# EAGLE design schematic (EAGLE 9.3.1)
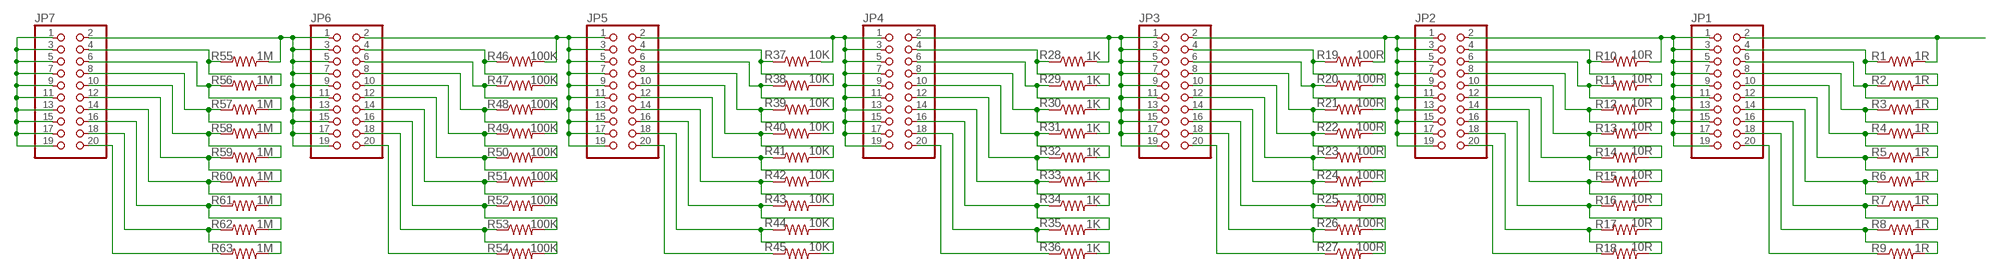
[diagram p0: schematic, sheet 1]

## Parts
JP1  PINHD-2X10_2.54-SMD  [2X10SMD]
JP2  PINHD-2X10_2.54-SMD  [2X10SMD]
JP3  PINHD-2X10_2.54-SMD  [2X10SMD]
JP4  PINHD-2X10_2.54-SMD  [2X10SMD]
JP5  PINHD-2X10_2.54-SMD  [2X10SMD]
JP6  PINHD-2X10_2.54-SMD  [2X10SMD]
JP7  PINHD-2X10_2.54-SMD  [2X10SMD]
R1  1R  RESISTOR1206  [1206]
R2  1R  RESISTOR1206  [1206]
R3  1R  RESISTOR1206  [1206]
R4  1R  RESISTOR1206  [1206]
R5  1R  RESISTOR1206  [1206]
R6  1R  RESISTOR1206  [1206]
R7  1R  RESISTOR1206  [1206]
R8  1R  RESISTOR1206  [1206]
R9  1R  RESISTOR1206  [1206]
R10  10R  RESISTOR2512  [R2512]
R11  10R  RESISTOR2512  [R2512]
R12  10R  RESISTOR2512  [R2512]
R13  10R  RESISTOR2512  [R2512]
R14  10R  RESISTOR2512  [R2512]
R15  10R  RESISTOR2512  [R2512]
R16  10R  RESISTOR2512  [R2512]
R17  10R  RESISTOR2512  [R2512]
R18  10R  RESISTOR2512  [R2512]
R19  100R  RESISTOR2512  [R2512]
R20  100R  RESISTOR2512  [R2512]
R21  100R  RESISTOR2512  [R2512]
R22  100R  RESISTOR2512  [R2512]
R23  100R  RESISTOR2512  [R2512]
R24  100R  RESISTOR2512  [R2512]
R25  100R  RESISTOR2512  [R2512]
R26  100R  RESISTOR2512  [R2512]
R27  100R  RESISTOR2512  [R2512]
R28  1K  RESISTOR2512  [R2512]
R29  1K  RESISTOR2512  [R2512]
R30  1K  RESISTOR2512  [R2512]
R31  1K  RESISTOR2512  [R2512]
R32  1K  RESISTOR2512  [R2512]
R33  1K  RESISTOR2512  [R2512]
R34  1K  RESISTOR2512  [R2512]
R35  1K  RESISTOR2512  [R2512]
R36  1K  RESISTOR2512  [R2512]
R37  10K  RESISTOR2512  [R2512]
R38  10K  RESISTOR2512  [R2512]
R39  10K  RESISTOR2512  [R2512]
R40  10K  RESISTOR2512  [R2512]
R41  10K  RESISTOR2512  [R2512]
R42  10K  RESISTOR2512  [R2512]
R43  10K  RESISTOR2512  [R2512]
R44  10K  RESISTOR2512  [R2512]
R45  10K  RESISTOR2512  [R2512]
R46  100K  RESISTOR2512  [R2512]
R47  100K  RESISTOR2512  [R2512]
R48  100K  RESISTOR2512  [R2512]
R49  100K  RESISTOR2512  [R2512]
R50  100K  RESISTOR2512  [R2512]
R51  100K  RESISTOR2512  [R2512]
R52  100K  RESISTOR2512  [R2512]
R53  100K  RESISTOR2512  [R2512]
R54  100K  RESISTOR2512  [R2512]
R55  1M  RESISTOR2512  [R2512]
R56  1M  RESISTOR2512  [R2512]
R57  1M  RESISTOR2512  [R2512]
R58  1M  RESISTOR2512  [R2512]
R59  1M  RESISTOR2512  [R2512]
R60  1M  RESISTOR2512  [R2512]
R61  1M  RESISTOR2512  [R2512]
R62  1M  RESISTOR2512  [R2512]
R63  1M  RESISTOR2512  [R2512]

## Nets
N$1: JP1.1 JP1.3 JP1.5 JP1.7 JP1.9 JP1.11 JP1.13 JP1.15 JP1.17 JP1.19 JP2.2 R10.2
N$2: JP1.2 R1.2
N$3: JP1.6 R2.1 R3.2
N$4: JP1.4 R1.1 R2.2
N$5: JP1.8 R3.1 R4.2
N$6: JP1.10 R4.1 R5.2
N$7: JP1.12 R5.1 R6.2
N$8: JP1.14 R6.1 R7.2
N$9: JP1.16 R7.1 R8.2
N$10: JP1.18 R8.1 R9.2
N$11: JP1.20 R9.1
N$12: JP2.1 JP2.3 JP2.5 JP2.7 JP2.9 JP2.11 JP2.13 JP2.15 JP2.17 JP2.19 JP3.2 R19.2
N$13: JP4.1 JP4.3 JP4.5 JP4.7 JP4.9 JP4.11 JP4.13 JP4.15 JP4.17 JP4.19 JP5.2 R37.2
N$14: JP2.4 R10.1 R11.2
N$15: JP2.6 R11.1 R12.2
N$16: JP2.8 R12.1 R13.2
N$17: JP2.10 R13.1 R14.2
N$18: JP2.12 R14.1 R15.2
N$19: JP2.14 R15.1 R16.2
N$20: JP2.16 R16.1 R17.2
N$21: JP2.18 R17.1 R18.2
N$22: JP2.20 R18.1
N$23: JP3.1 JP3.3 JP3.5 JP3.7 JP3.9 JP3.11 JP3.13 JP3.15 JP3.17 JP3.19 JP4.2 R28.2
N$24: JP6.1 JP6.3 JP6.5 JP6.7 JP6.9 JP6.11 JP6.13 JP6.15 JP6.17 JP6.19 JP7.2 R55.2
N$25: JP3.4 R19.1 R20.2
N$26: JP3.6 R20.1 R21.2
N$27: JP3.8 R21.1 R22.2
N$28: JP3.10 R22.1 R23.2
N$29: JP3.12 R23.1 R24.2
N$30: JP3.14 R24.1 R25.2
N$31: JP3.16 R25.1 R26.2
N$32: JP3.18 R26.1 R27.2
N$33: JP3.20 R27.1
N$36: JP4.4 R28.1 R29.2
N$37: JP4.6 R29.1 R30.2
N$38: JP4.8 R30.1 R31.2
N$39: JP4.10 R31.1 R32.2
N$40: JP4.12 R32.1 R33.2
N$41: JP4.14 R33.1 R34.2
N$42: JP4.16 R34.1 R35.2
N$43: JP4.18 R35.1 R36.2
N$44: JP4.20 R36.1
N$45: JP5.1 JP5.3 JP5.5 JP5.7 JP5.9 JP5.11 JP5.13 JP5.15 JP5.17 JP5.19 JP6.2 R46.2
N$47: JP5.4 R37.1 R38.2
N$48: JP5.6 R38.1 R39.2
N$49: JP5.8 R39.1 R40.2
N$50: JP5.10 R40.1 R41.2
N$51: JP5.12 R41.1 R42.2
N$52: JP5.14 R42.1 R43.2
N$53: JP5.16 R43.1 R44.2
N$54: JP5.18 R44.1 R45.2
N$55: JP5.20 R45.1
N$57: JP7.1 JP7.3 JP7.5 JP7.7 JP7.9 JP7.11 JP7.13 JP7.15 JP7.17 JP7.19
N$58: JP6.4 R46.1 R47.2
N$59: JP6.6 R47.1 R48.2
N$60: JP6.8 R48.1 R49.2
N$61: JP6.10 R49.1 R50.2
N$62: JP6.12 R50.1 R51.2
N$63: JP6.14 R51.1 R52.2
N$64: JP6.16 R52.1 R53.2
N$65: JP6.18 R53.1 R54.2
N$66: JP6.20 R54.1
N$69: JP7.4 R55.1 R56.2
N$70: JP7.6 R56.1 R57.2
N$71: JP7.8 R57.1 R58.2
N$72: JP7.10 R58.1 R59.2
N$73: JP7.12 R59.1 R60.2
N$74: JP7.14 R60.1 R61.2
N$75: JP7.16 R61.1 R62.2
N$76: JP7.18 R62.1 R63.2
N$77: JP7.20 R63.1

## Library data of the parts
JP1-JP7 = pinhead-2:PINHD-2X10: PIN HEADER
R1-R63 = SparkFun-Passives:RESISTOR: Resistor Basic schematic elements and footprints for 0603, 1206, and PTH resistors.

## Board
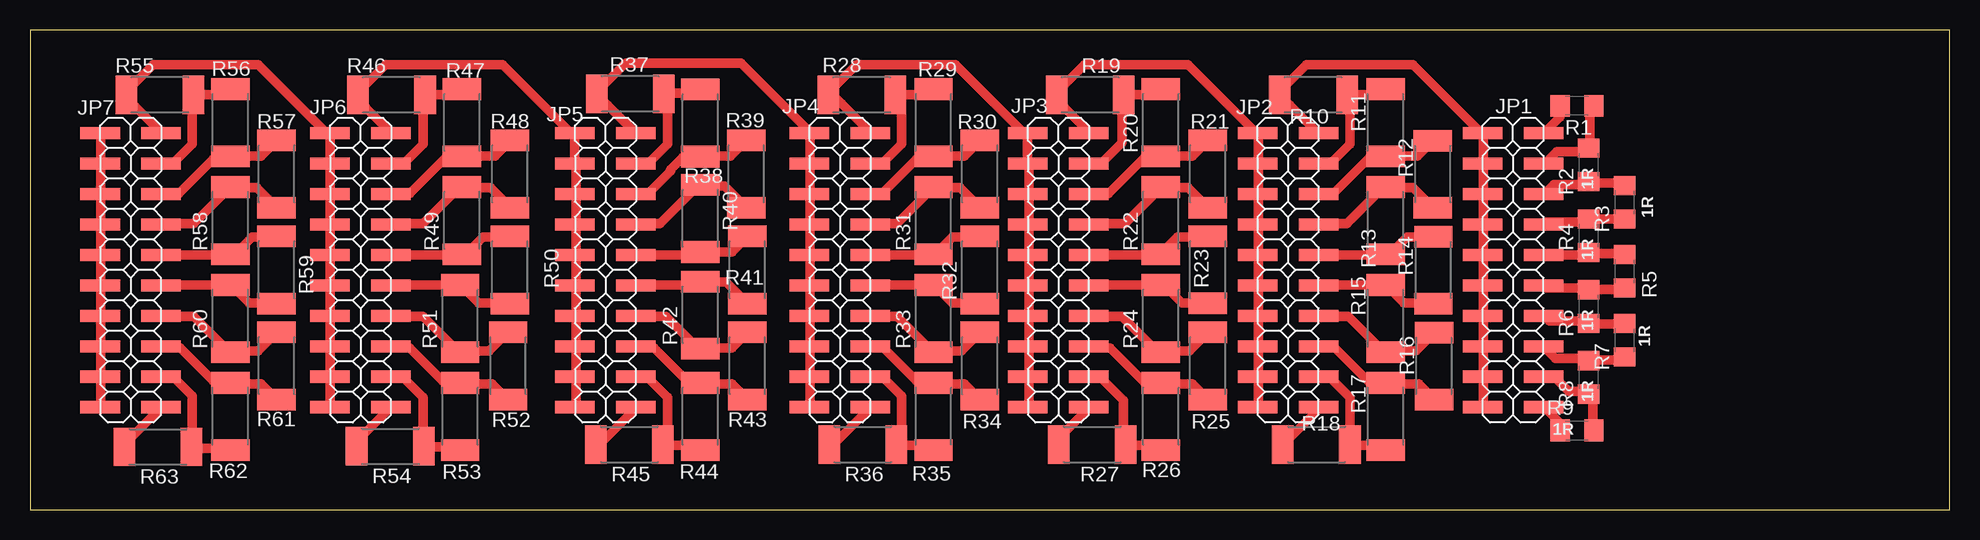
[diagram p1: board, top side]

Size 160 x 40 mm. Coordinates in mm from the lower left corner, seen from the top.
Outline: 0,0 160,0 160,40 0,40 0,0
Copper layers (1*16): Top 0.035mm / dielectric 1.5mm / Bottom 0.035mm
Design rules "default *": minimum track width 0.8mm, minimum drill 0.35mm, track to track 0.5mm, track to pad 0.5mm, pad to pad 0.5mm, via to via 0.5mm, smd to smd 0.5mm, copper to edge 0.5mm, drill to drill 0.5mm, minimum pad ring 10mil, minimum via ring 8mil, stop-mask expansion 4mil, vias tented up to drill 0mil, thermal gap 10mil

### Footprints (pad centres in the part's own frame; a part is rotated, then mirrored left to right if it is on the bottom)
2X10SMD = smd 1.016 x 3.302: 1 -1.27,-3.81; 2 -1.27,1.27; 3 1.27,-3.81; 4 1.27,1.27; 5 3.81,-3.81; 6 3.81,1.27; 7 6.35,-3.81; 8 6.35,1.27; 9 8.89,-3.81; 10 8.89,1.27; 11 11.43,-3.81; 12 11.43,1.27; 13 13.97,-3.81; 14 13.97,1.27; 15 16.51,-3.81; 16 16.51,1.27; 17 19.05,-3.81; 18 19.05,1.27; 19 21.59,-3.81; 20 21.59,1.27
1206 = smd 1.6 x 1.8: 1 -1.4,0; 2 1.4,0
R2512 = smd 1.8 x 3.2: 1 -2.8,0; 2 2.8,0

### Placement (x,y rotation side)
JP1  124.88,30.13 270 top
JP2  106.13,30.13 270 top
JP3  86.98,30.13 270 top
JP4  68.77,30.13 270 top
JP5  49.23,30.13 270 top
JP6  28.82,30.13 270 top
JP7  9.66,30.13 270 top
R1  128.94,33.66 180 top
R2  129.93,28.75 90 top
R3  132.93,25.63 90 top
R4  129.93,22.84 90 top
R5  132.93,19.88 90 top
R6  129.93,16.93 90 top
R7  132.93,14.13 90 top
R8  129.93,11.02 90 top
R9  128.94,6.61 0 top
R10  106.98,34.58 180 top
R11  112.99,32.26 90 top
R12  116.93,27.97 90 top
R13  112.99,24.1 90 top
R14  116.98,19.97 90 top
R15  112.99,15.93 90 top
R16  117.03,11.97 90 top
R17  112.99,7.76 90 top
R18  107.22,5.43 0 top
R19  88.38,34.58 180 top
R20  94.26,32.26 90 top
R21  98.16,27.98 90 top
R22  94.26,24.1 90 top
R23  98.16,20 90 top
R24  94.26,15.93 90 top
R25  98.16,11.98 90 top
R26  94.26,7.76 90 top
R27  88.54,5.43 0 top
R28  69.34,34.58 180 top
R29  75.31,32.26 90 top
R30  79.16,27.98 90 top
R31  75.31,24.1 90 top
R32  79.16,19.98 90 top
R33  75.31,15.93 90 top
R34  79.16,11.98 90 top
R35  75.31,7.76 90 top
R36  69.41,5.43 0 top
R37  50.04,34.67 180 top
R38  55.88,32.24 90 top
R39  59.71,27.98 90 top
R40  55.87,24.28 90 top
R41  59.79,19.98 90 top
R42  55.87,16.22 90 top
R43  59.79,11.98 90 top
R44  55.87,7.76 90 top
R45  49.96,5.43 0 top
R46  30.14,34.58 180 top
R47  36,32.26 90 top
R48  40,27.98 90 top
R49  36,24.1 90 top
R50  40,19.98 90 top
R51  35.85,15.93 90 top
R52  39.85,11.98 90 top
R53  35.85,7.76 90 top
R54  30.03,5.28 0 top
R55  10.83,34.58 180 top
R56  16.7,32.26 90 top
R57  20.55,27.98 90 top
R58  16.7,24.1 90 top
R59  20.55,19.98 90 top
R60  16.7,15.93 90 top
R61  20.55,11.98 90 top
R62  16.7,7.76 90 top
R63  10.67,5.23 0 top

### Tracks (layer width: path | path; a pad name or v marks a point on that pad's centre or on a via)
N$1
  Top 0.8: 104.25,34.5 104,34.75 106.38,37.12 115.25,37.12 120.75,31.62 JP1.1 121.12,31.38 121.12,29.25 JP1.3 121.12,28.75 121.12,26.62 JP1.5 121.12,26.25 121.12,24.12 JP1.7 121.12,23.75 121.12,21.62 JP1.9 121.12,21.12 121.12,19 JP1.11 121.12,18.62 121.12,16.5 JP1.13 121.12,16.12 121.12,14 JP1.15 121.12,13.5 121.12,11.38 JP1.17 121.12,11 121.12,8.62 JP1.19 | 104.25,34.5 105,33.75 107.38,31.38 JP2.2 | 104.25,34.5 R10.2
N$2
  Top 0.8: R1.2 127.5,33.62 127.5,32.75 126.25,31.5 JP1.2
N$3
  Top 0.8: R3.2 132.88,27.12 132.75,27.25 130,27.25 R2.1 129.62,27.12 127,27.12 126.25,26.38 JP1.6
N$4
  Top 0.8: R1.1 130.02,32.9 130,32.88 130,30.25 R2.2 129.62,29.88 127.25,29.88 126.25,28.88 JP1.4
N$5
  Top 0.8: R3.1 132.88,24.25 130,24.25 R4.2 129.62,24 126.38,24 126.25,23.88 JP1.8
N$6
  Top 0.8: R5.2 132.88,21.38 130,21.38 R4.1 129.62,21.25 126.25,21.25 JP1.10
N$7
  Top 0.8: R5.1 132.88,18.38 130,18.38 R6.2 129.62,18.5 126.38,18.5 126.25,18.62 JP1.12
N$8
  Top 0.8: R7.2 132.88,15.5 130,15.5 R6.1 129.62,15.75 126.62,15.75 126.25,16.12 JP1.14
N$9
  Top 0.8: R7.1 132.88,12.62 132.75,12.5 130,12.5 R8.2 129.62,12.62 127.12,12.62 126.25,13.5 JP1.16
N$10
  Top 0.8: R9.2 130.25,6.62 130.25,9.25 130,9.5 R8.1 129.62,9.88 128.25,9.88 127.12,11 126.25,11 JP1.18
N$11
  Top 0.8: R9.1 127.5,6.62 127.5,7.25 126.25,8.5 JP1.20
N$12
  Top 0.8: 85.62,34.12 85.62,34.5 R19.2 | 85.62,34.12 85.25,34.5 87.88,37.12 96.5,37.12 102,31.62 JP2.1 102.38,31.38 102.38,29.25 JP2.3 102.38,28.75 102.38,26.62 JP2.5 102.38,26.25 102.38,24.12 JP2.7 102.38,23.75 102.38,21.62 JP2.9 102.38,21.12 102.38,19 JP2.11 102.38,18.62 102.38,16.5 JP2.13 102.38,16.12 102.38,14 JP2.15 102.38,13.5 102.38,11.38 JP2.17 102.38,11 102.38,8.62 JP2.19 | 85.62,34.12 86.25,33.5 88.25,31.5 JP3.2
N$13
  Top 0.8: 47.25,34.62 47.12,34.75 49.62,37.25 59.25,37.25 64.75,31.75 JP4.1 65,31.38 65,29.25 JP4.3 65,28.75 65,26.62 JP4.5 65,26.25 65,24.12 JP4.7 65,23.75 65,21.62 JP4.9 65,21.12 65,19 JP4.11 65,18.62 65,16.5 JP4.13 65,16.12 65,14 JP4.15 65,13.5 65,11.38 JP4.17 65,11 65,8.62 JP4.19 | 47.25,34.62 48.12,33.75 50.5,31.38 JP5.2 | 47.25,34.62 R37.2
N$14
  Top 0.8: R11.2 112.88,35 112.5,34.62 109.88,34.62 R10.1 110,34.25 110,30.5 108.38,28.88 107.5,28.88 JP2.4
N$15
  Top 0.8: R12.2 116.88,30.75 115.62,29.5 113,29.5 R11.1 112.62,29.38 111.62,29.38 108.62,26.38 107.5,26.38 JP2.6
N$16
  Top 0.8: R12.1 116.88,25.25 115.25,26.88 113,26.88 R13.2 112.62,26.75 109.75,23.88 107.5,23.88 JP2.8
N$17
  Top 0.8: JP2.10 107.5,21.25 112.88,21.25 R13.1 113.38,21.38 114.75,22.75 116.88,22.75 R14.2
N$18
  Top 0.8: JP2.12 107.5,18.75 112.88,18.75 R15.2 113.25,18.5 114.5,17.25 116.88,17.25 R14.1
N$19
  Top 0.8: R16.2 117,14.75 115.5,13.25 113,13.25 R15.1 112.62,13.38 109.88,16.12 107.5,16.12 JP2.14
N$20
  Top 0.8: R16.1 117,9.25 115.75,10.5 113,10.5 R17.2 112.62,10.62 111.62,10.62 108.75,13.5 107.5,13.5 JP2.16
N$21
  Top 0.8: R17.1 112.88,5 112.5,5.38 110.12,5.38 R18.2 110,5.75 110,9.38 108.38,11 107.5,11 JP2.18
N$22
  Top 0.8: R18.1 104.5,5.5 107.5,8.5 JP2.20
N$23
  Top 0.8: 67,34.5 66.62,34.5 R28.2 | 67,34.5 66.62,34.88 68.88,37.12 77.12,37.12 82.75,31.5 JP3.1 83.12,31.38 83.12,29.25 JP3.3 83.25,28.75 83.25,26.62 JP3.5 83.25,26.25 83.25,24.12 JP3.7 83.25,23.75 83.25,21.62 JP3.9 83.25,21.12 83.25,19 JP3.11 83.25,18.62 83.25,16.5 JP3.13 83.25,16.12 83.25,14 JP3.15 83.25,13.5 83.25,11.38 JP3.17 83.25,11 83.25,8.62 JP3.19 | 67,34.5 67.62,33.88 70,31.5 JP4.2
N$24
  Top 0.8: 8.12,34.25 8.12,34.5 R55.2 | 8.12,34.25 7.75,34.62 10.25,37.12 19,37.12 24.62,31.5 JP6.1 25,31.38 25,29.25 JP6.3 25,28.75 25,26.62 JP6.5 25,26.25 25,24.12 JP6.7 25,23.75 25,21.62 JP6.9 25,21.12 25,19 JP6.11 25,18.62 25,16.5 JP6.13 25,16.12 25,14 JP6.15 25,13.5 25,11.38 JP6.17 25,11 25,8.62 JP6.19 | 8.12,34.25 8.75,33.62 10.88,31.5 JP7.2
N$25
  Top 0.8: R20.2 94.25,35 93.88,34.62 91.25,34.62 R19.1 91,34.25 91,30.62 89.25,28.88 88.38,28.88 JP3.4
N$26
  Top 0.8: R21.2 98.12,30.75 96.88,29.5 94.38,29.5 R20.1 93.88,29.38 92.88,29.38 89.88,26.38 88.38,26.38 JP3.6
N$27
  Top 0.8: R21.1 98.12,25.25 96.5,26.88 94.38,26.88 R22.2 94,26.62 91.25,23.88 88.38,23.88 JP3.8
N$28
  Top 0.8: JP3.10 88.38,21.25 94.25,21.25 R22.1 94.5,21.62 95.62,22.75 98.12,22.75 R23.2
N$29
  Top 0.8: JP3.12 88.38,18.75 94.25,18.75 R24.2 94.62,18.62 96,17.25 98.12,17.25 R23.1
N$30
  Top 0.8: R25.2 98.12,14.75 96.62,13.25 94.38,13.25 R24.1 93.88,13.25 91,16.12 88.38,16.12 JP3.14
N$31
  Top 0.8: R25.1 98.12,9.25 96.88,10.5 94.38,10.5 R26.2 93.88,10.62 92.88,10.62 90,13.5 88.38,13.5 JP3.16
N$32
  Top 0.8: R26.1 94.25,5 93.88,5.38 91.38,5.38 R27.2 91.12,5.75 91.12,9.12 89.25,11 88.38,11 JP3.18
N$33
  Top 0.8: R27.1 85.75,5.5 85.75,6 88.25,8.5 JP3.20
N$36
  Top 0.8: R29.2 75.25,35 74.88,34.62 72.25,34.62 R28.1 72.62,34.25 72.62,30.5 71,28.88 70.12,28.88 JP4.4
N$37
  Top 0.8: R30.2 79.12,30.75 77.88,29.5 75.38,29.5 R29.1 75,29.25 73.88,29.25 71,26.38 70.12,26.38 JP4.6
N$38
  Top 0.8: R30.1 79.12,25.25 77.5,26.88 75.38,26.88 R31.2 75,26.62 72.25,23.88 70.12,23.88 JP4.8
N$39
  Top 0.8: JP4.10 70.12,21.25 75.25,21.25 R31.1 75.62,21.5 76.88,22.75 79.12,22.75 R32.2
N$40
  Top 0.8: JP4.12 70.12,18.75 75.25,18.75 R33.2 75.62,18.5 76.88,17.25 79.12,17.25 R32.1
N$41
  Top 0.8: R34.2 79.12,14.75 77.62,13.25 75.38,13.25 R33.1 75,13.38 72.25,16.12 70.12,16.12 JP4.14
N$42
  Top 0.8: R34.1 79.12,9.25 77.88,10.5 75.38,10.5 R35.2 75,10.75 73.88,10.75 71.12,13.5 70.12,13.5 JP4.16
N$43
  Top 0.8: R35.1 75.25,5 74.88,5.38 72.25,5.38 R36.2 72.62,5.75 72.62,9.5 71.12,11 70.12,11 JP4.18
N$44
  Top 0.8: R36.1 66.62,5.5 67,5.5 70,8.5 JP4.20
N$45
  Top 0.8: 27.38,34.12 27.38,34.5 R46.2 | 27.38,34.12 27,34.5 29.62,37.12 39.38,37.12 45,31.5 JP5.1 45.38,31.38 45.38,29.25 JP5.3 45.5,28.75 45.5,26.62 JP5.5 45.5,26.25 45.5,24.12 JP5.7 45.5,23.75 45.5,21.62 JP5.9 45.5,21.12 45.5,19 JP5.11 45.5,18.62 45.5,16.5 JP5.13 45.5,16.12 45.5,14 JP5.15 45.5,13.5 45.5,11.38 JP5.17 45.5,11 45.5,8.62 JP5.19 | 27.38,34.12 28,33.5 30,31.5 JP6.2
N$47
  Top 0.8: R38.2 55.88,35 55.62,34.75 52.88,34.75 R37.1 53.12,34.38 53.12,30.5 51.5,28.88 50.5,28.88 JP5.4
N$48
  Top 0.8: R39.2 59.62,30.75 58.38,29.5 56,29.5 R38.1 55.5,29.38 54.38,29.38 53.38,28.38 53.38,28.25 51.5,26.38 50.5,26.38 JP5.6
N$49
  Top 0.8: R39.1 59.62,25.25 57.88,27 55.88,27 R40.2 55.5,26.88 52.5,23.88 50.5,23.88 JP5.8
N$50
  Top 0.8: R41.2 59.75,22.75 58.5,21.5 55.88,21.5 R40.1 55.62,21.25 JP5.10
N$51
  Top 0.8: R41.1 59.75,17.25 58,19 55.88,19 R42.2 55.62,18.75 50.5,18.75 JP5.12
N$52
  Top 0.8: R43.2 59.75,14.75 58.5,13.5 55.88,13.5 R42.1 55.5,13.62 53,16.12 50.5,16.12 JP5.14
N$53
  Top 0.8: R43.1 59.75,9.25 58.5,10.5 55.88,10.5 R44.2 55.5,10.62 54.88,10.62 52,13.5 50.5,13.5 JP5.16
N$54
  Top 0.8: R44.1 55.75,5 55.38,5.38 52.88,5.38 R45.2 53.12,5.75 53.12,9.38 51.5,11 50.5,11 JP5.18
N$55
  Top 0.8: R45.1 47.25,5.5 47.5,5.5 50.5,8.5 JP5.20
N$57
  Top 0.8: JP7.19 5.88,8.62 5.88,11 JP7.17 5.88,11.5 5.88,13.5 JP7.15 5.88,14 5.88,16.12 JP7.13 5.88,16.5 5.88,18.62 JP7.11 5.88,19.12 5.88,21.12 JP7.9 5.88,21.62 5.88,23.75 JP7.7 5.88,24.12 5.88,26.25 JP7.5 5.88,26.62 5.88,28.75 JP7.3 5.88,29.25 5.88,31.38 JP7.1
N$58
  Top 0.8: R47.2 36,35 35.62,34.62 33,34.62 R46.1 32.75,34.25 32.75,30.5 31.12,28.88 30.12,28.88 JP6.4
N$59
  Top 0.8: R48.2 40,30.75 38.75,29.5 36,29.5 R47.1 35.62,29.38 34.62,29.38 31.62,26.38 30.12,26.38 JP6.6
N$60
  Top 0.8: R48.1 40,25.25 38.38,26.88 36,26.88 R49.2 35.62,26.75 32.75,23.88 30.12,23.88 JP6.8
N$61
  Top 0.8: JP6.10 30.12,21.25 36,21.25 R49.1 36.38,21.38 37.75,22.75 40,22.75 R50.2
N$62
  Top 0.8: JP6.12 30.12,18.75 35.75,18.75 R51.2 36.12,18.5 37.38,17.25 40,17.25 R50.1
N$63
  Top 0.8: R52.2 39.75,14.75 38.25,13.25 35.88,13.25 R51.1 35.5,13.38 32.75,16.12 30.12,16.12 JP6.14
N$64
  Top 0.8: R52.1 39.75,9.25 38.5,10.5 35.88,10.5 R53.2 35.5,10.75 34.38,10.75 31.62,13.5 30.12,13.5 JP6.16
N$65
  Top 0.8: R53.1 35.75,5 35.5,5.25 32.88,5.25 R54.2 32.75,5.62 32.75,9.38 31.12,11 30.12,11 JP6.18
N$66
  Top 0.8: R54.1 27.25,5.38 27.25,5.75 30,8.5 JP6.20
N$69
  Top 0.8: R56.2 16.62,35 16.25,34.62 13.75,34.62 R55.1 13.5,34.25 13.5,30.5 11.88,28.88 11,28.88 JP7.4
N$70
  Top 0.8: R57.2 20.5,30.75 19.25,29.5 16.75,29.5 R56.1 16.38,29.25 15.25,29.25 12.38,26.38 11,26.38 JP7.6
N$71
  Top 0.8: R57.1 20.5,25.25 18.88,26.88 16.75,26.88 R58.2 16.38,26.62 13.62,23.88 11,23.88 JP7.8
N$72
  Top 0.8: JP7.10 11,21.25 16.62,21.25 R58.1 17.12,21.38 18.5,22.75 20.5,22.75 R59.2
N$73
  Top 0.8: JP7.12 11,18.75 16.62,18.75 R60.2 17,18.5 18.25,17.25 20.5,17.25 R59.1
N$74
  Top 0.8: R61.2 20.5,14.75 19,13.25 16.75,13.25 R60.1 16.38,13.38 13.62,16.12 11,16.12 JP7.14
N$75
  Top 0.8: R61.1 20.5,9.25 19.25,10.5 16.75,10.5 R62.2 16.38,10.75 15.25,10.75 12.5,13.5 11,13.5 JP7.16
N$76
  Top 0.8: R62.1 16.62,5 16.5,5.12 13.5,5.12 R63.2 13.5,5.62 13.5,9.5 12,11 11,11 JP7.18
N$77
  Top 0.8: R63.1 7.88,5.25 7.88,5.5 10.88,8.5 JP7.20